# EAGLE schematic Main_Board (EAGLE 7.6.0)
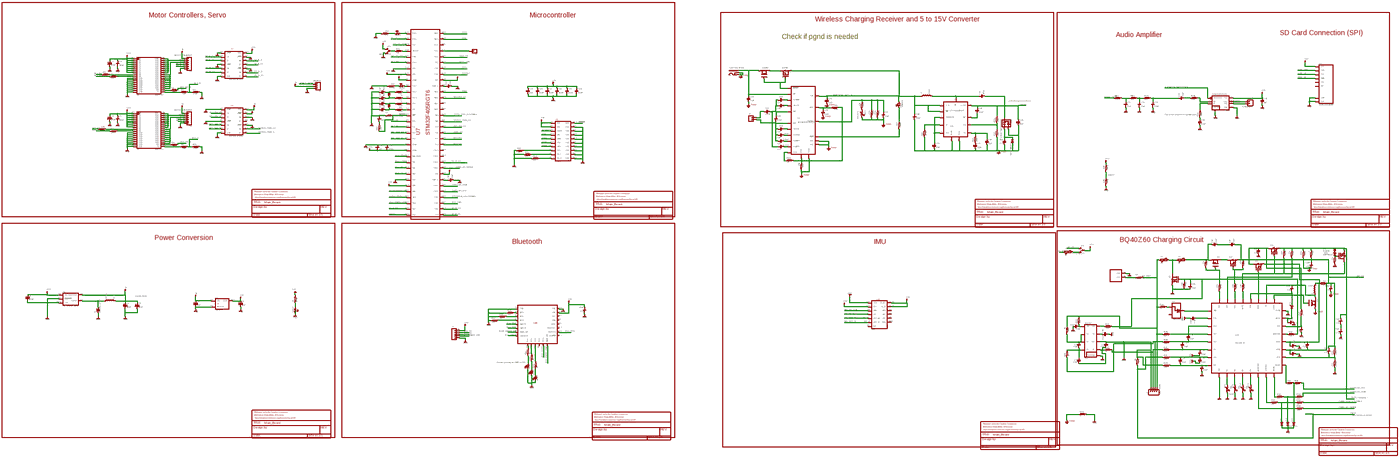
[diagram p0: schematic, sheet 1, overview]
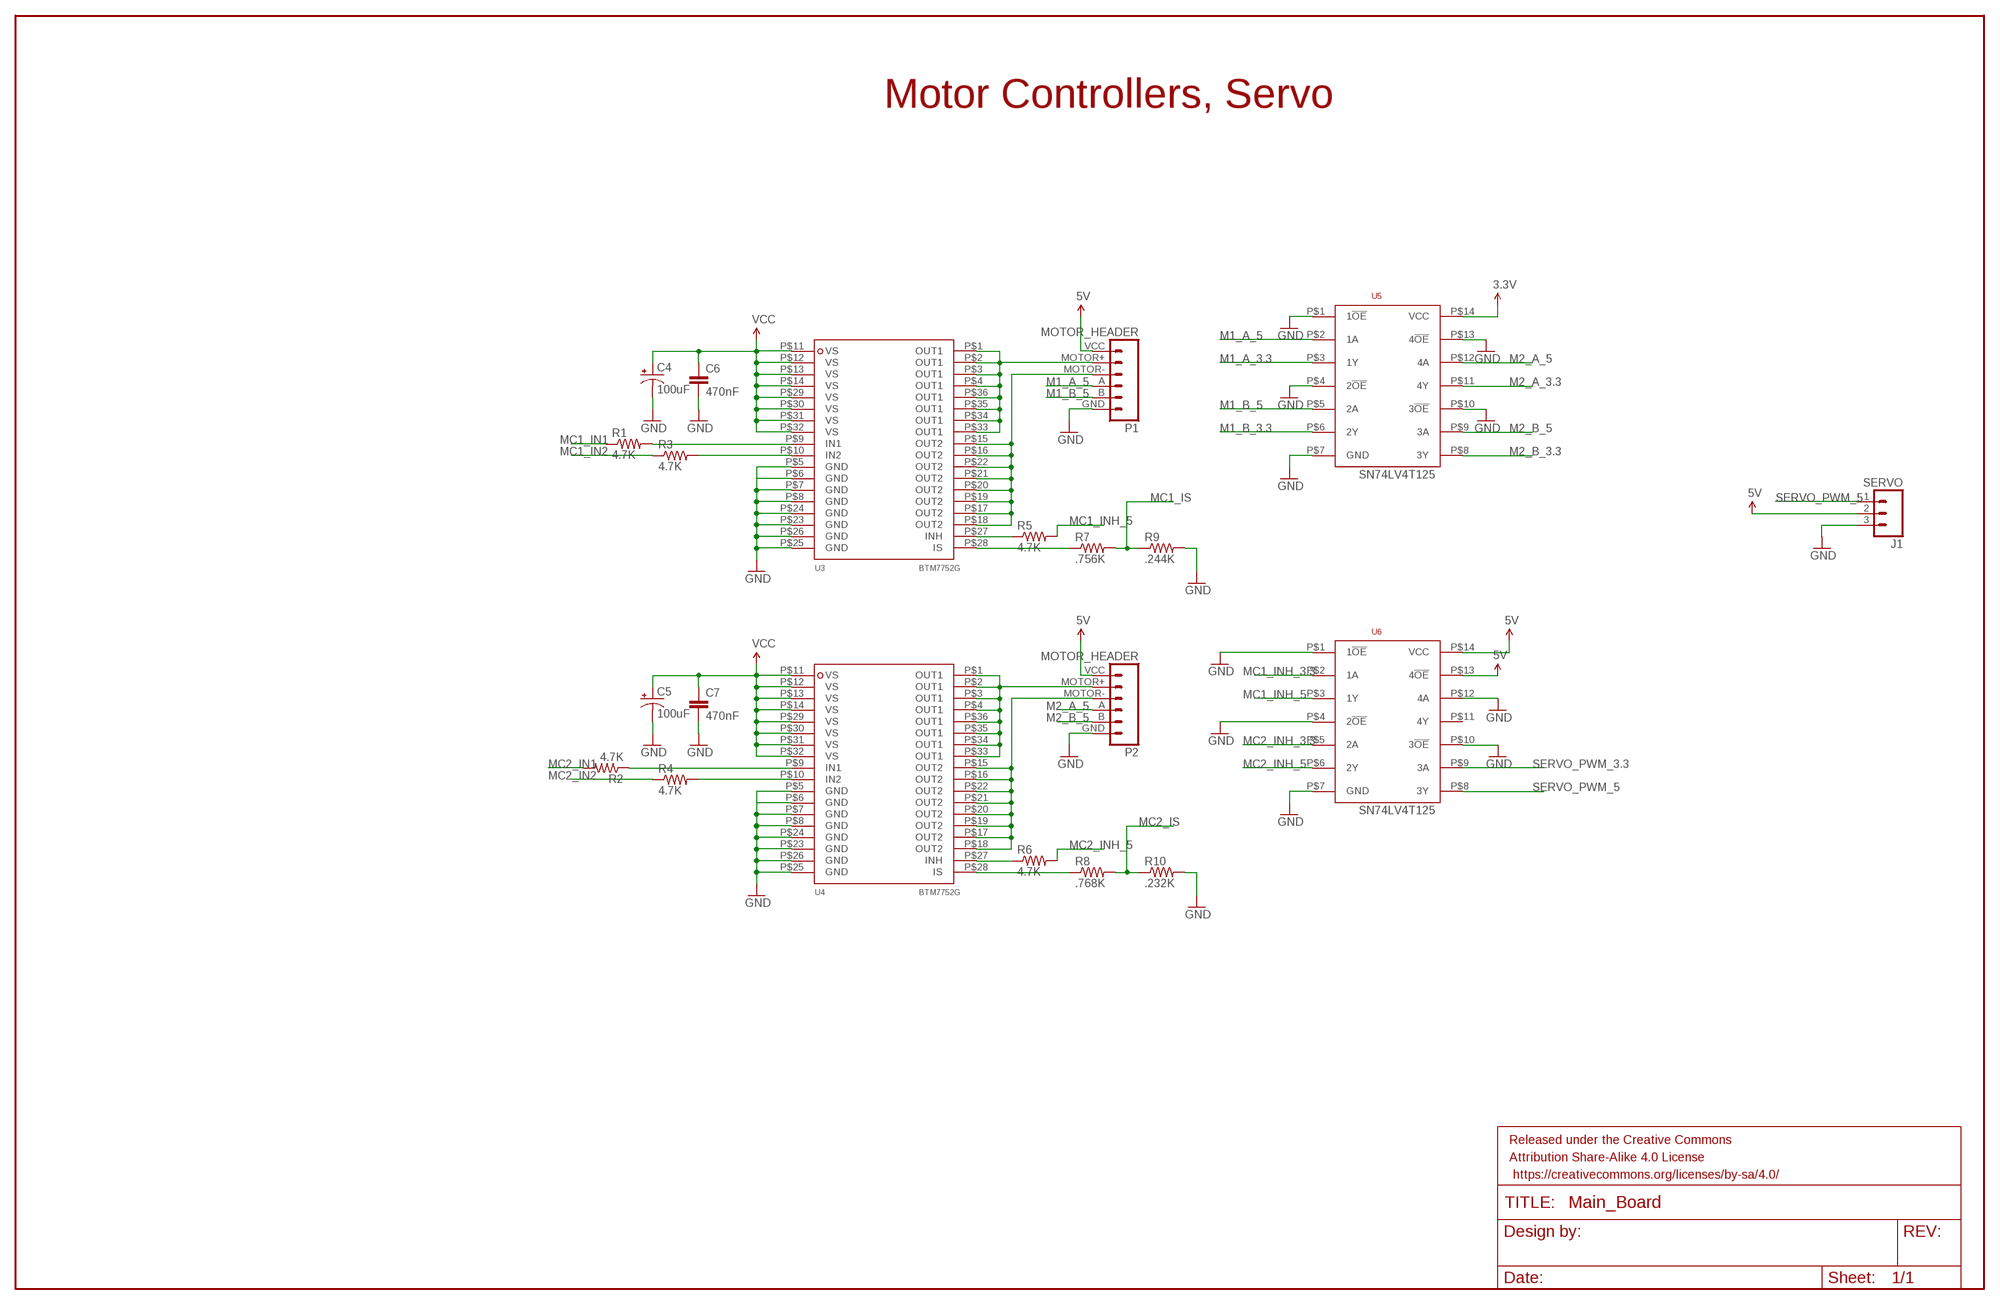
[diagram p1: schematic, sheet 1, part 1 of 8]
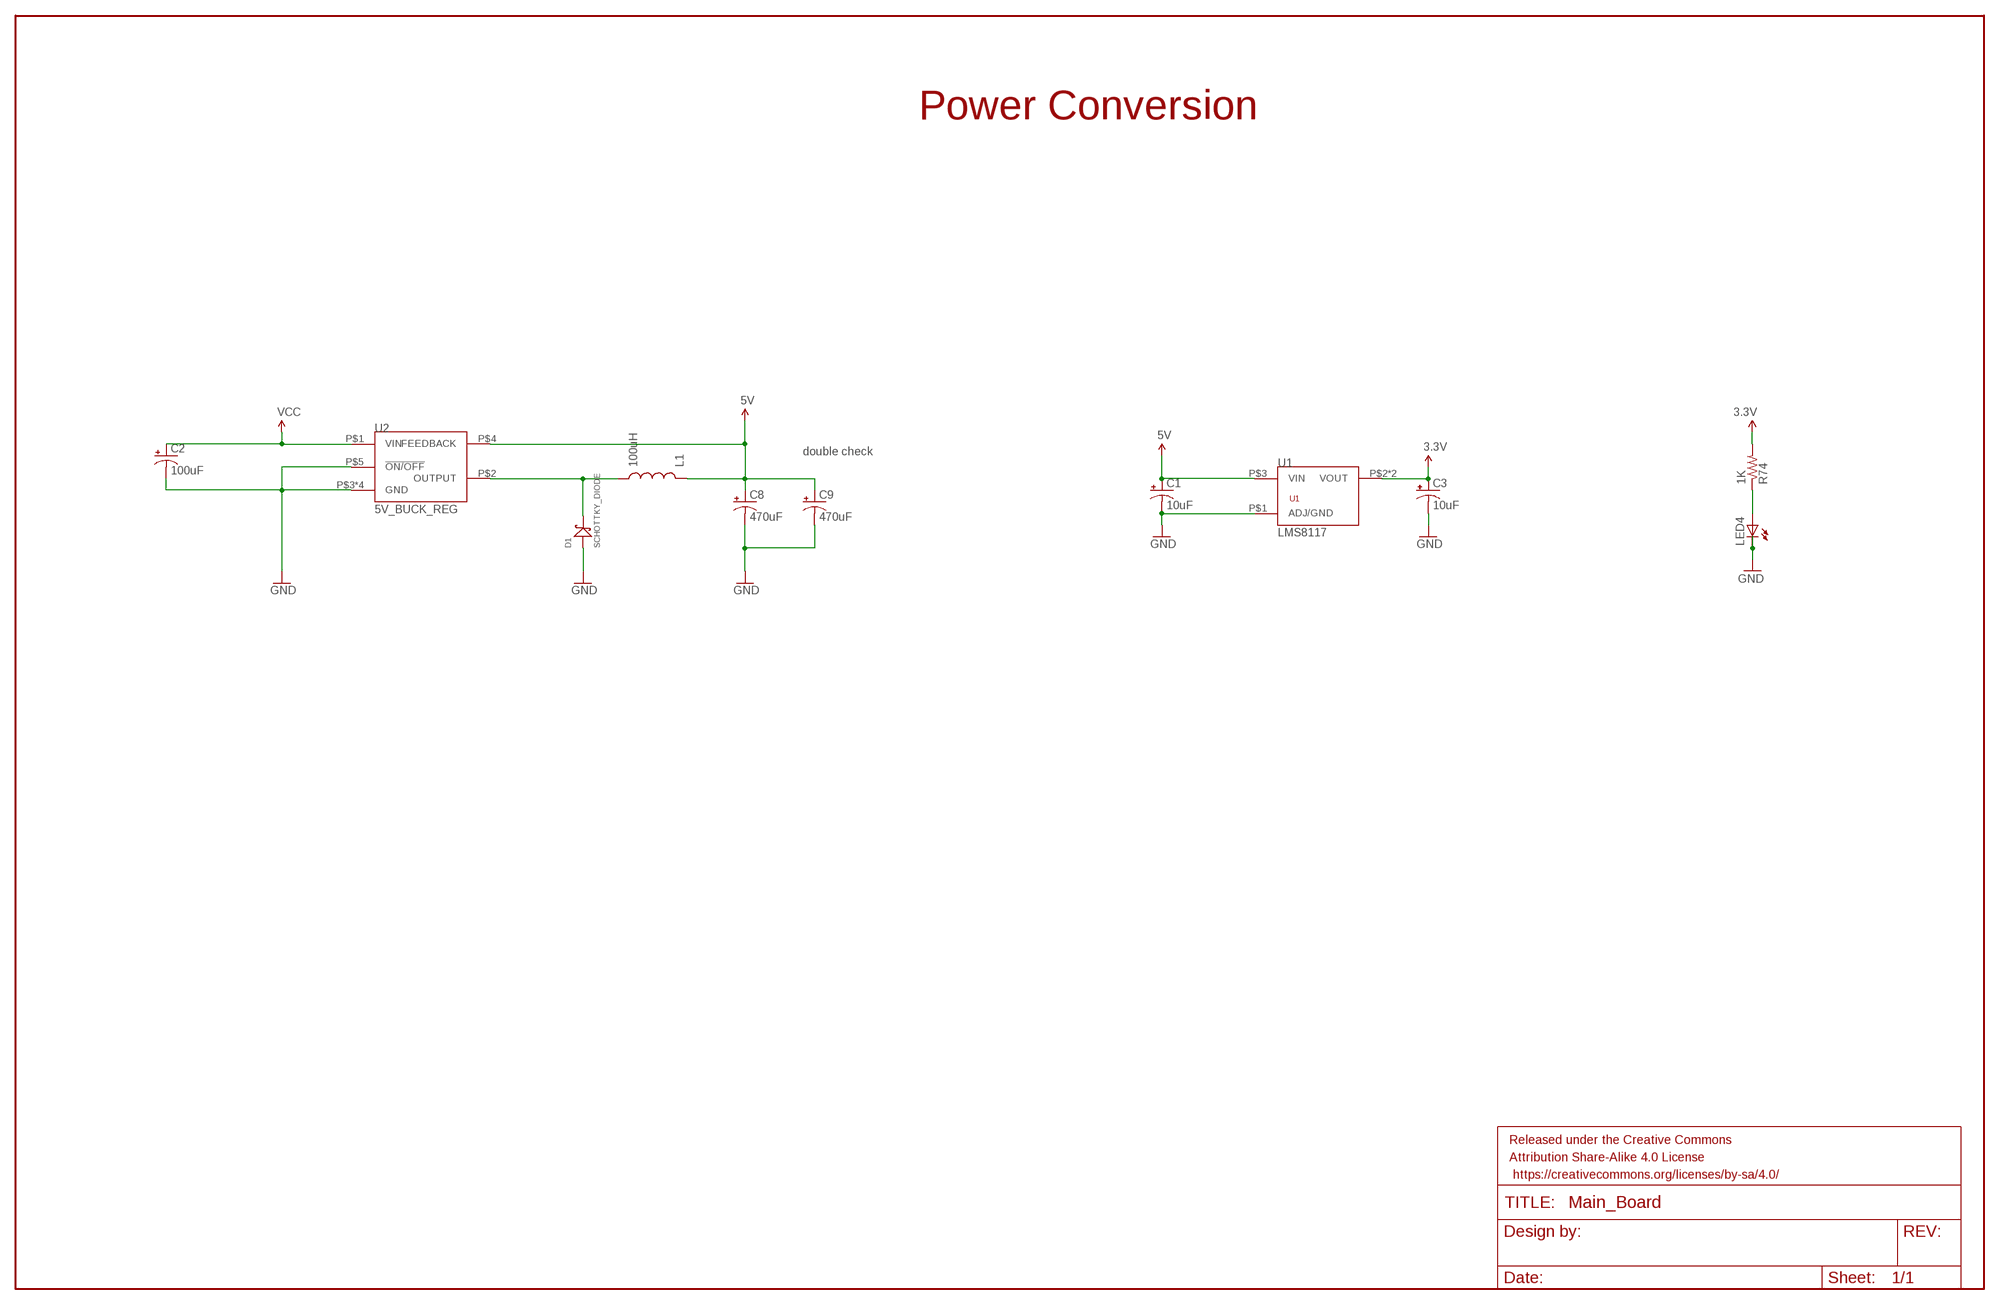
[diagram p2: schematic, sheet 1, part 2 of 8]
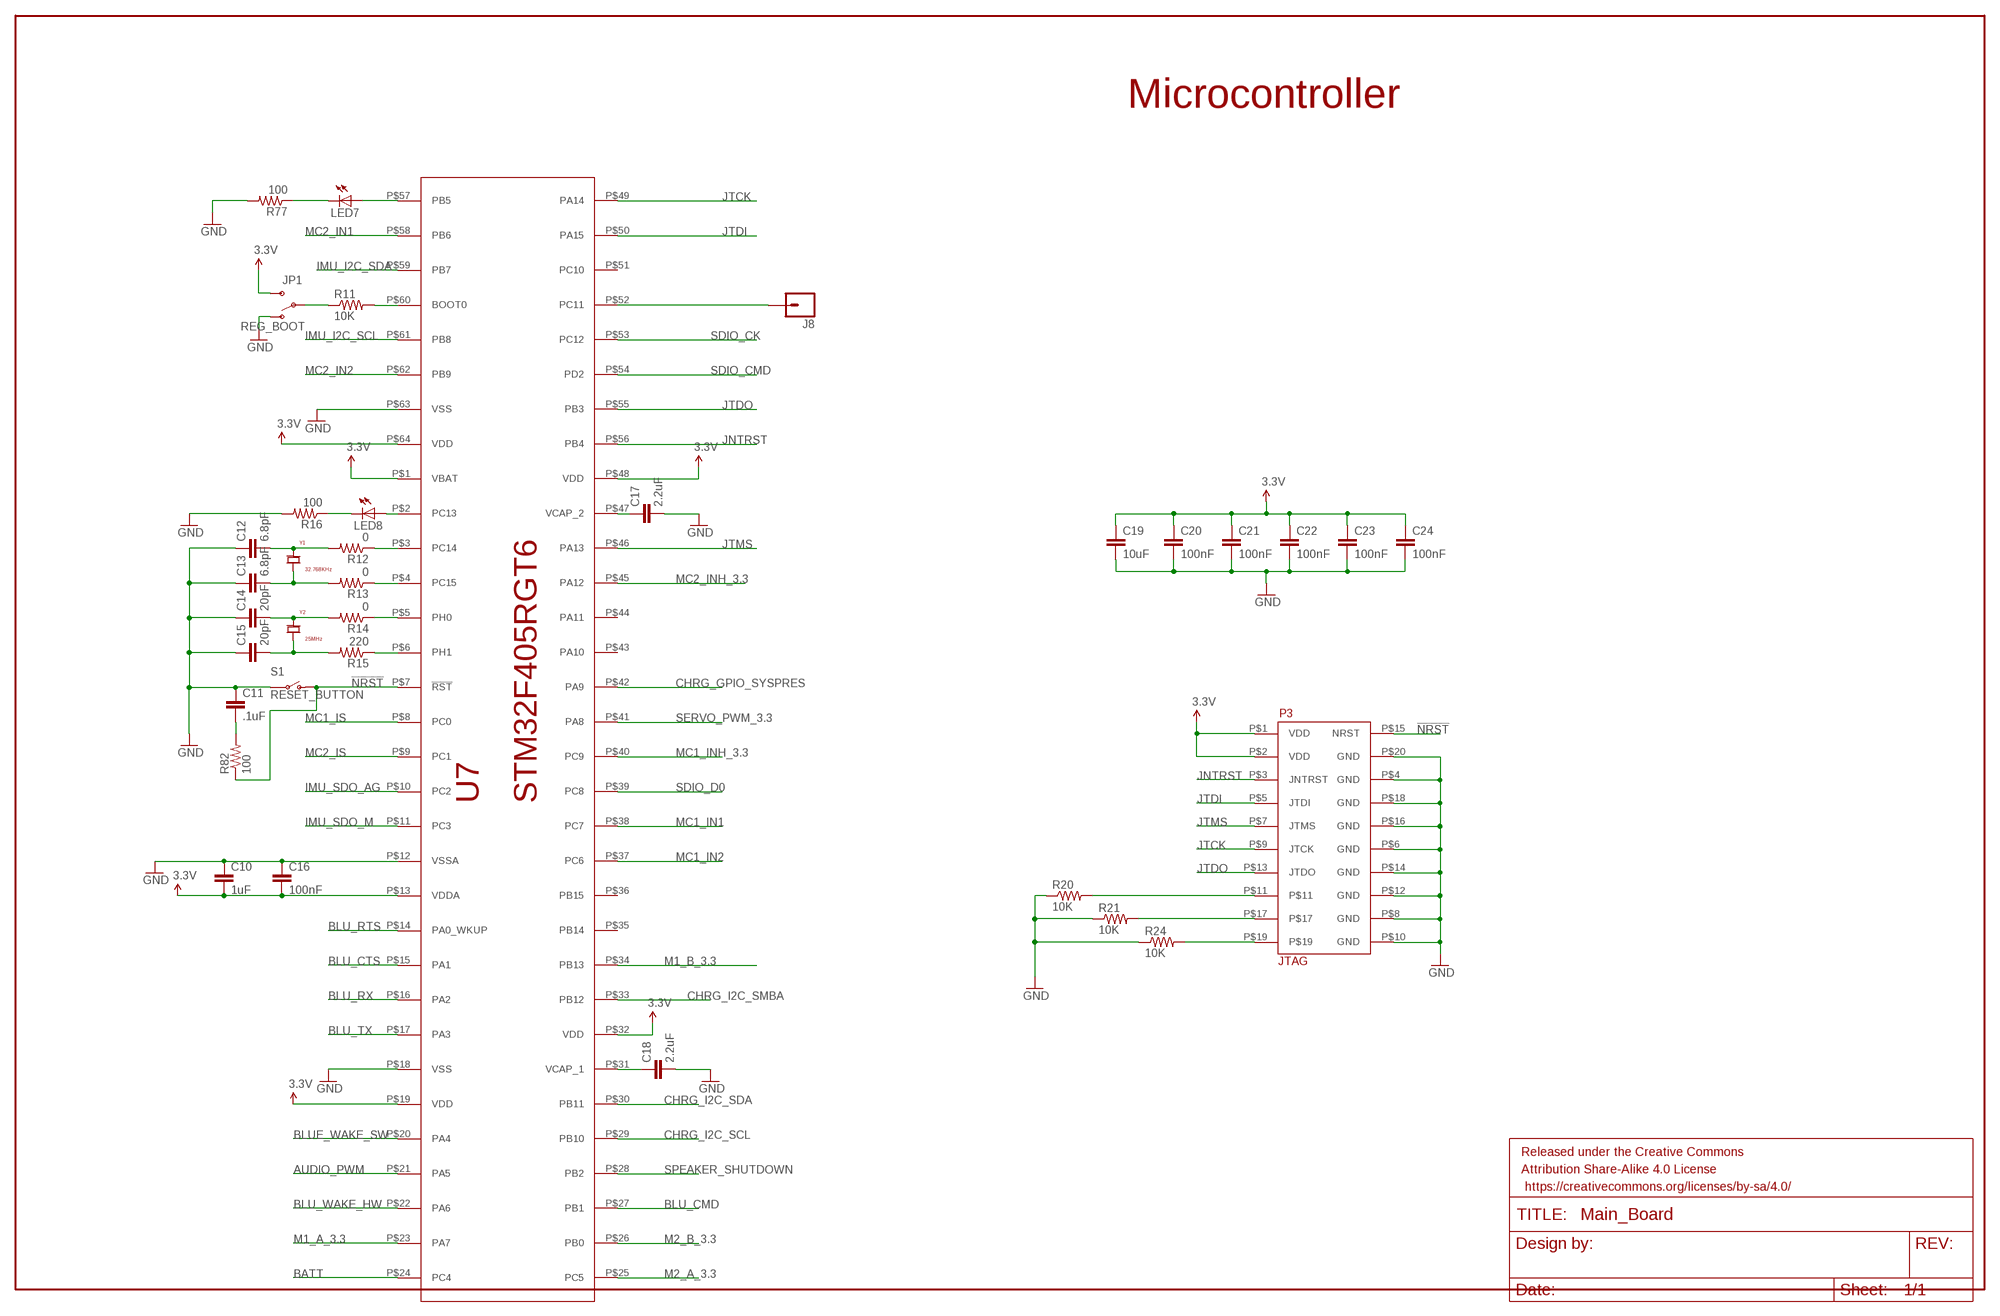
[diagram p3: schematic, sheet 1, part 3 of 8]
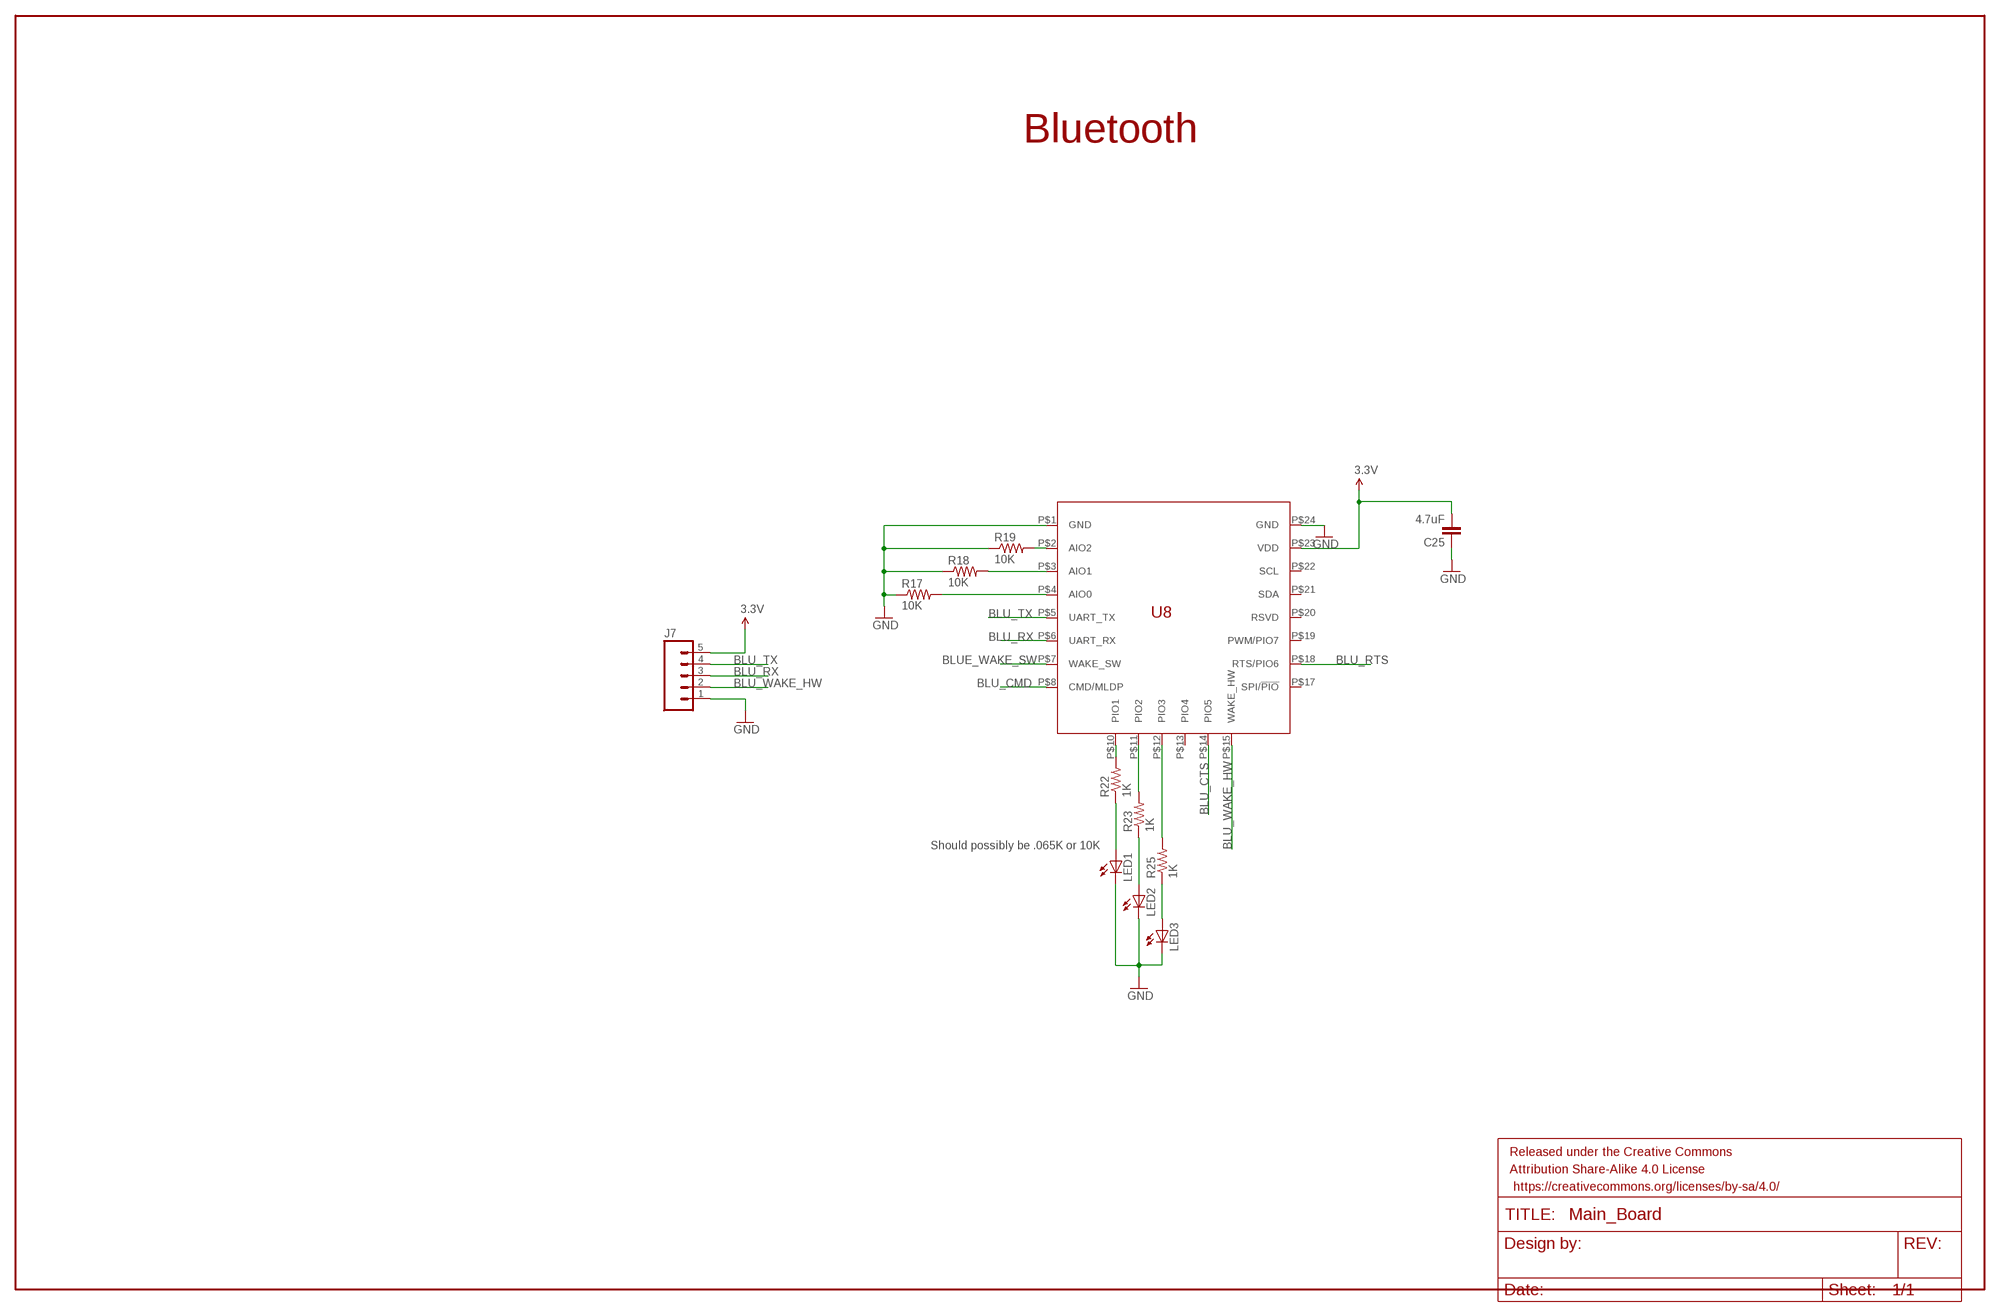
[diagram p4: schematic, sheet 1, part 4 of 8]
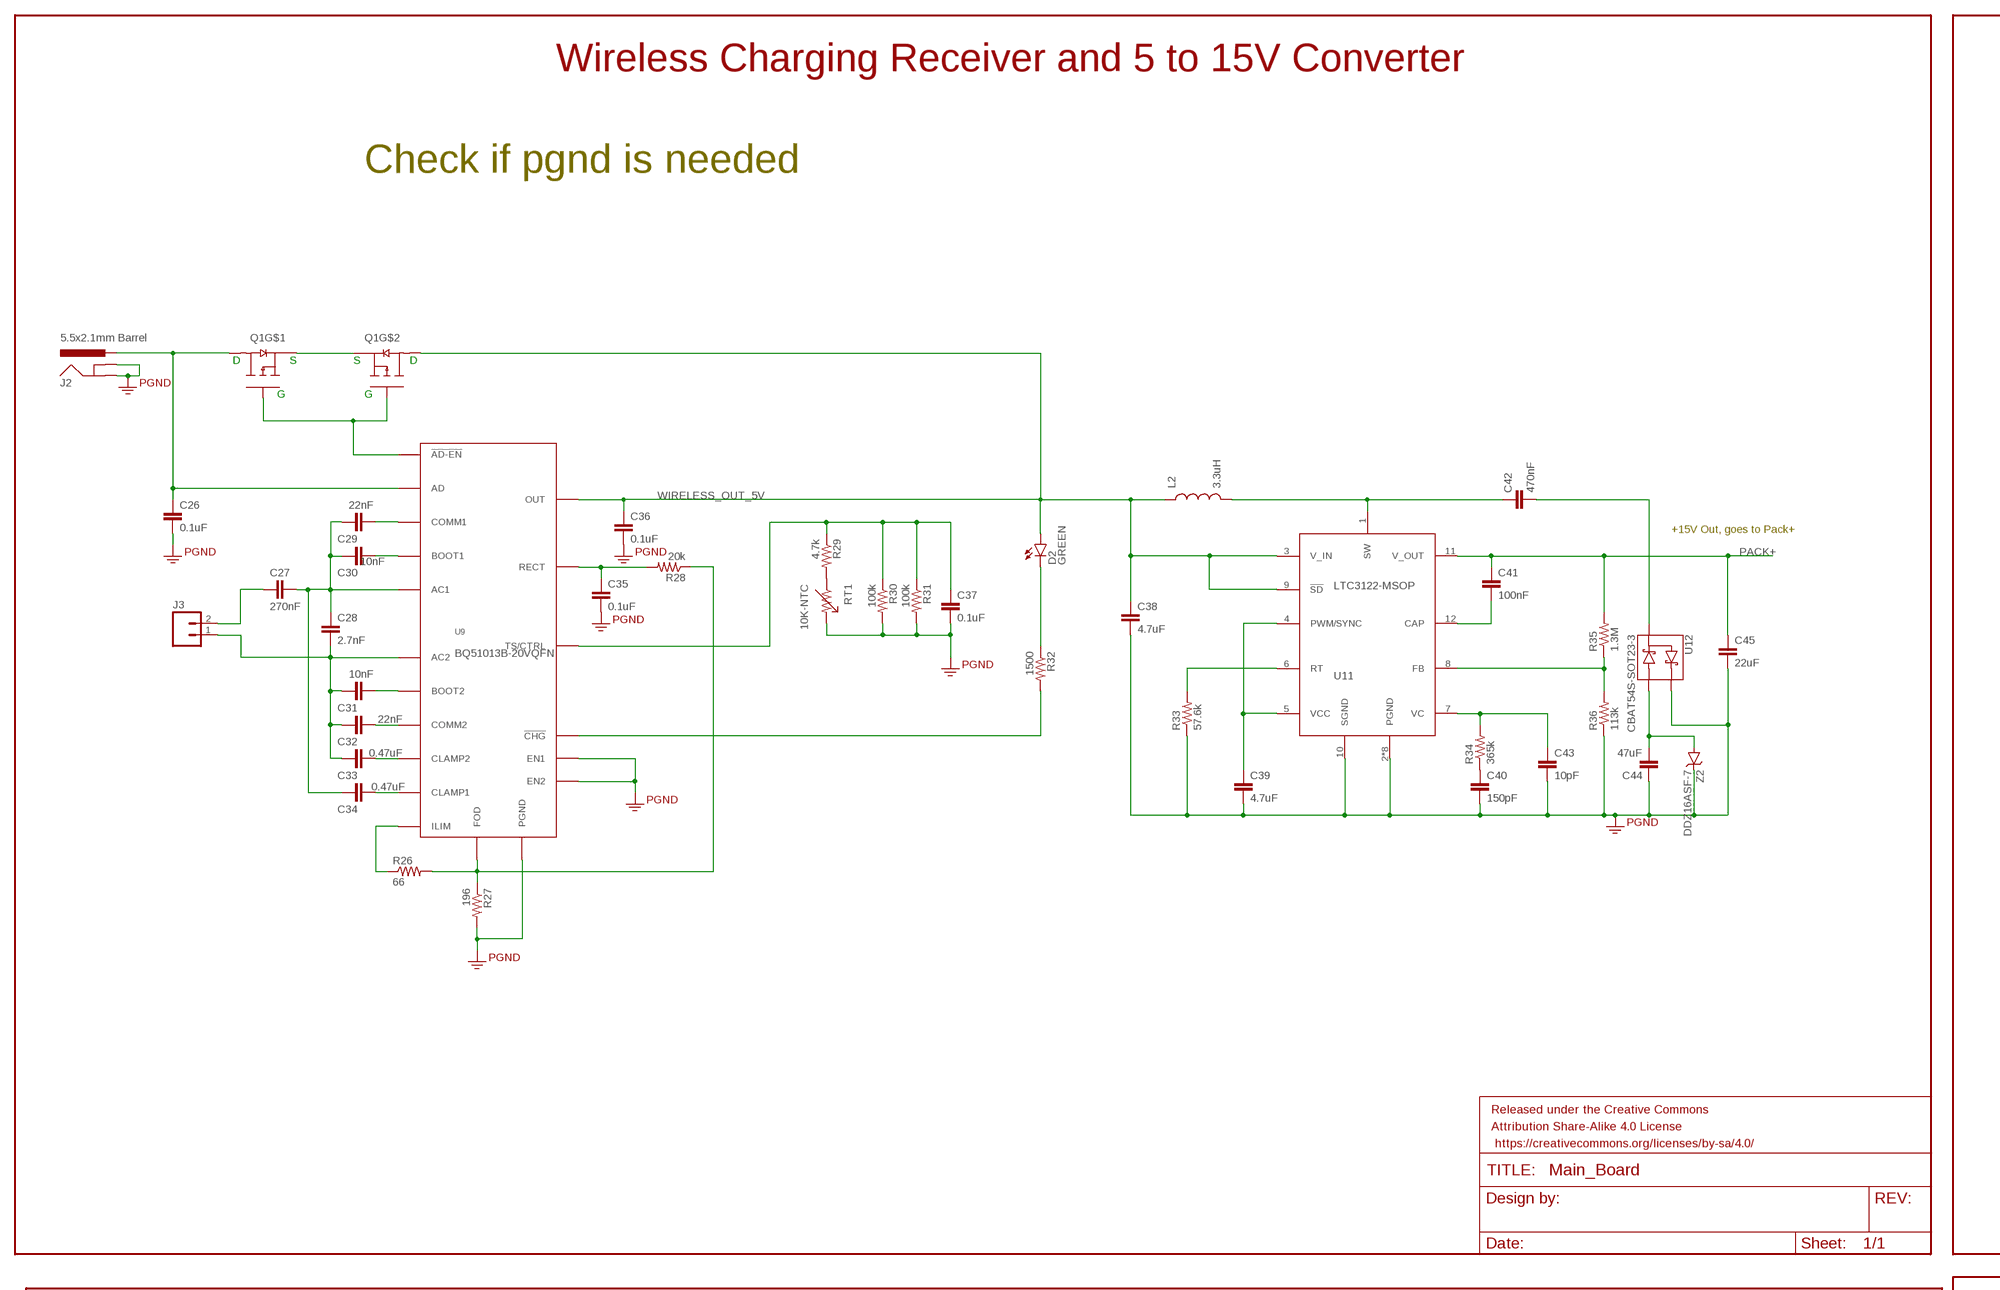
[diagram p5: schematic, sheet 1, part 5 of 8]
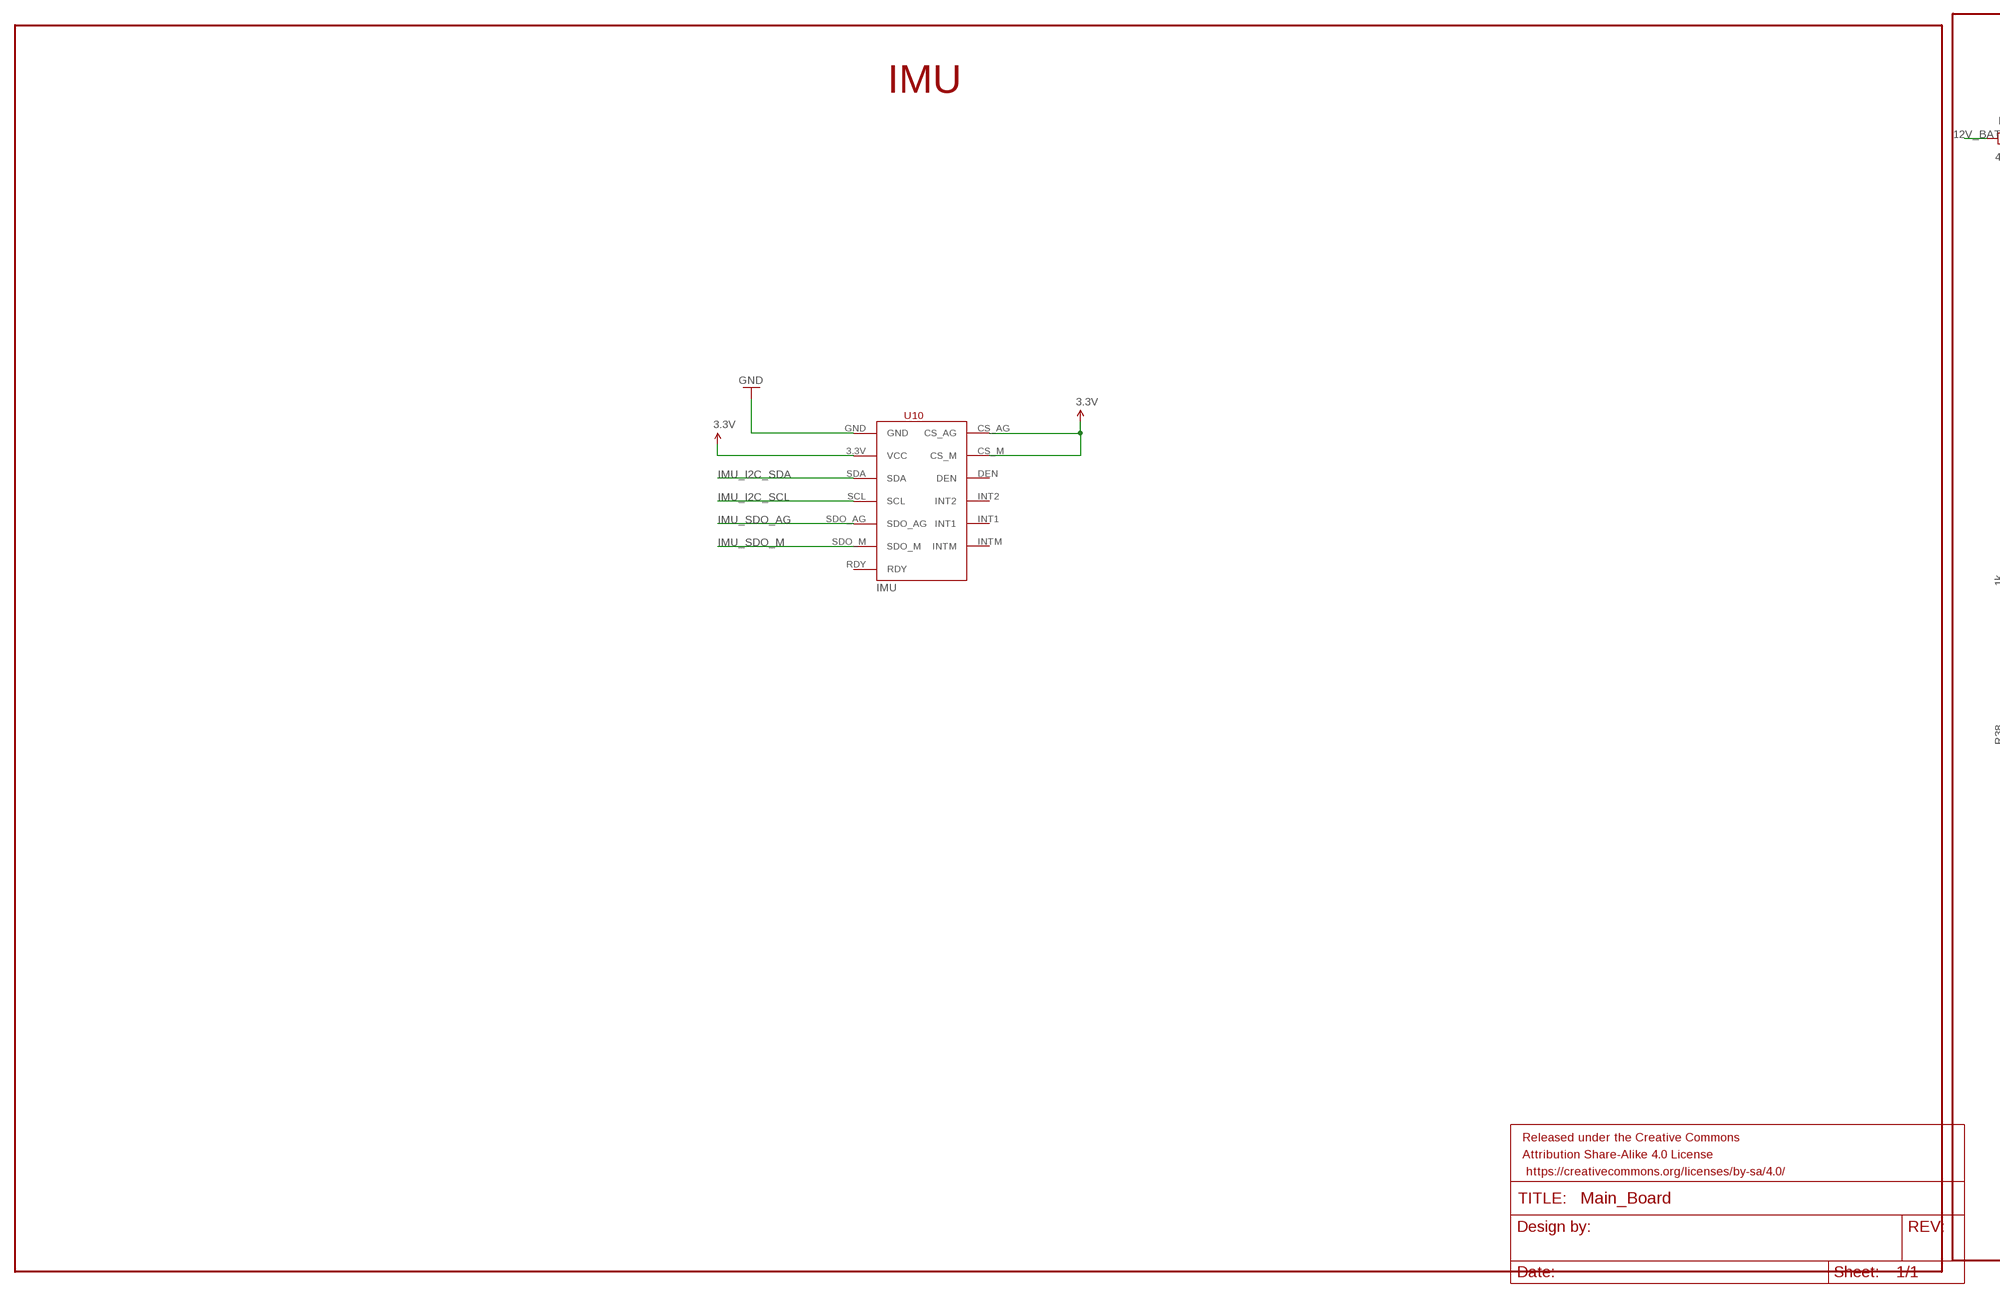
[diagram p6: schematic, sheet 1, part 6 of 8]
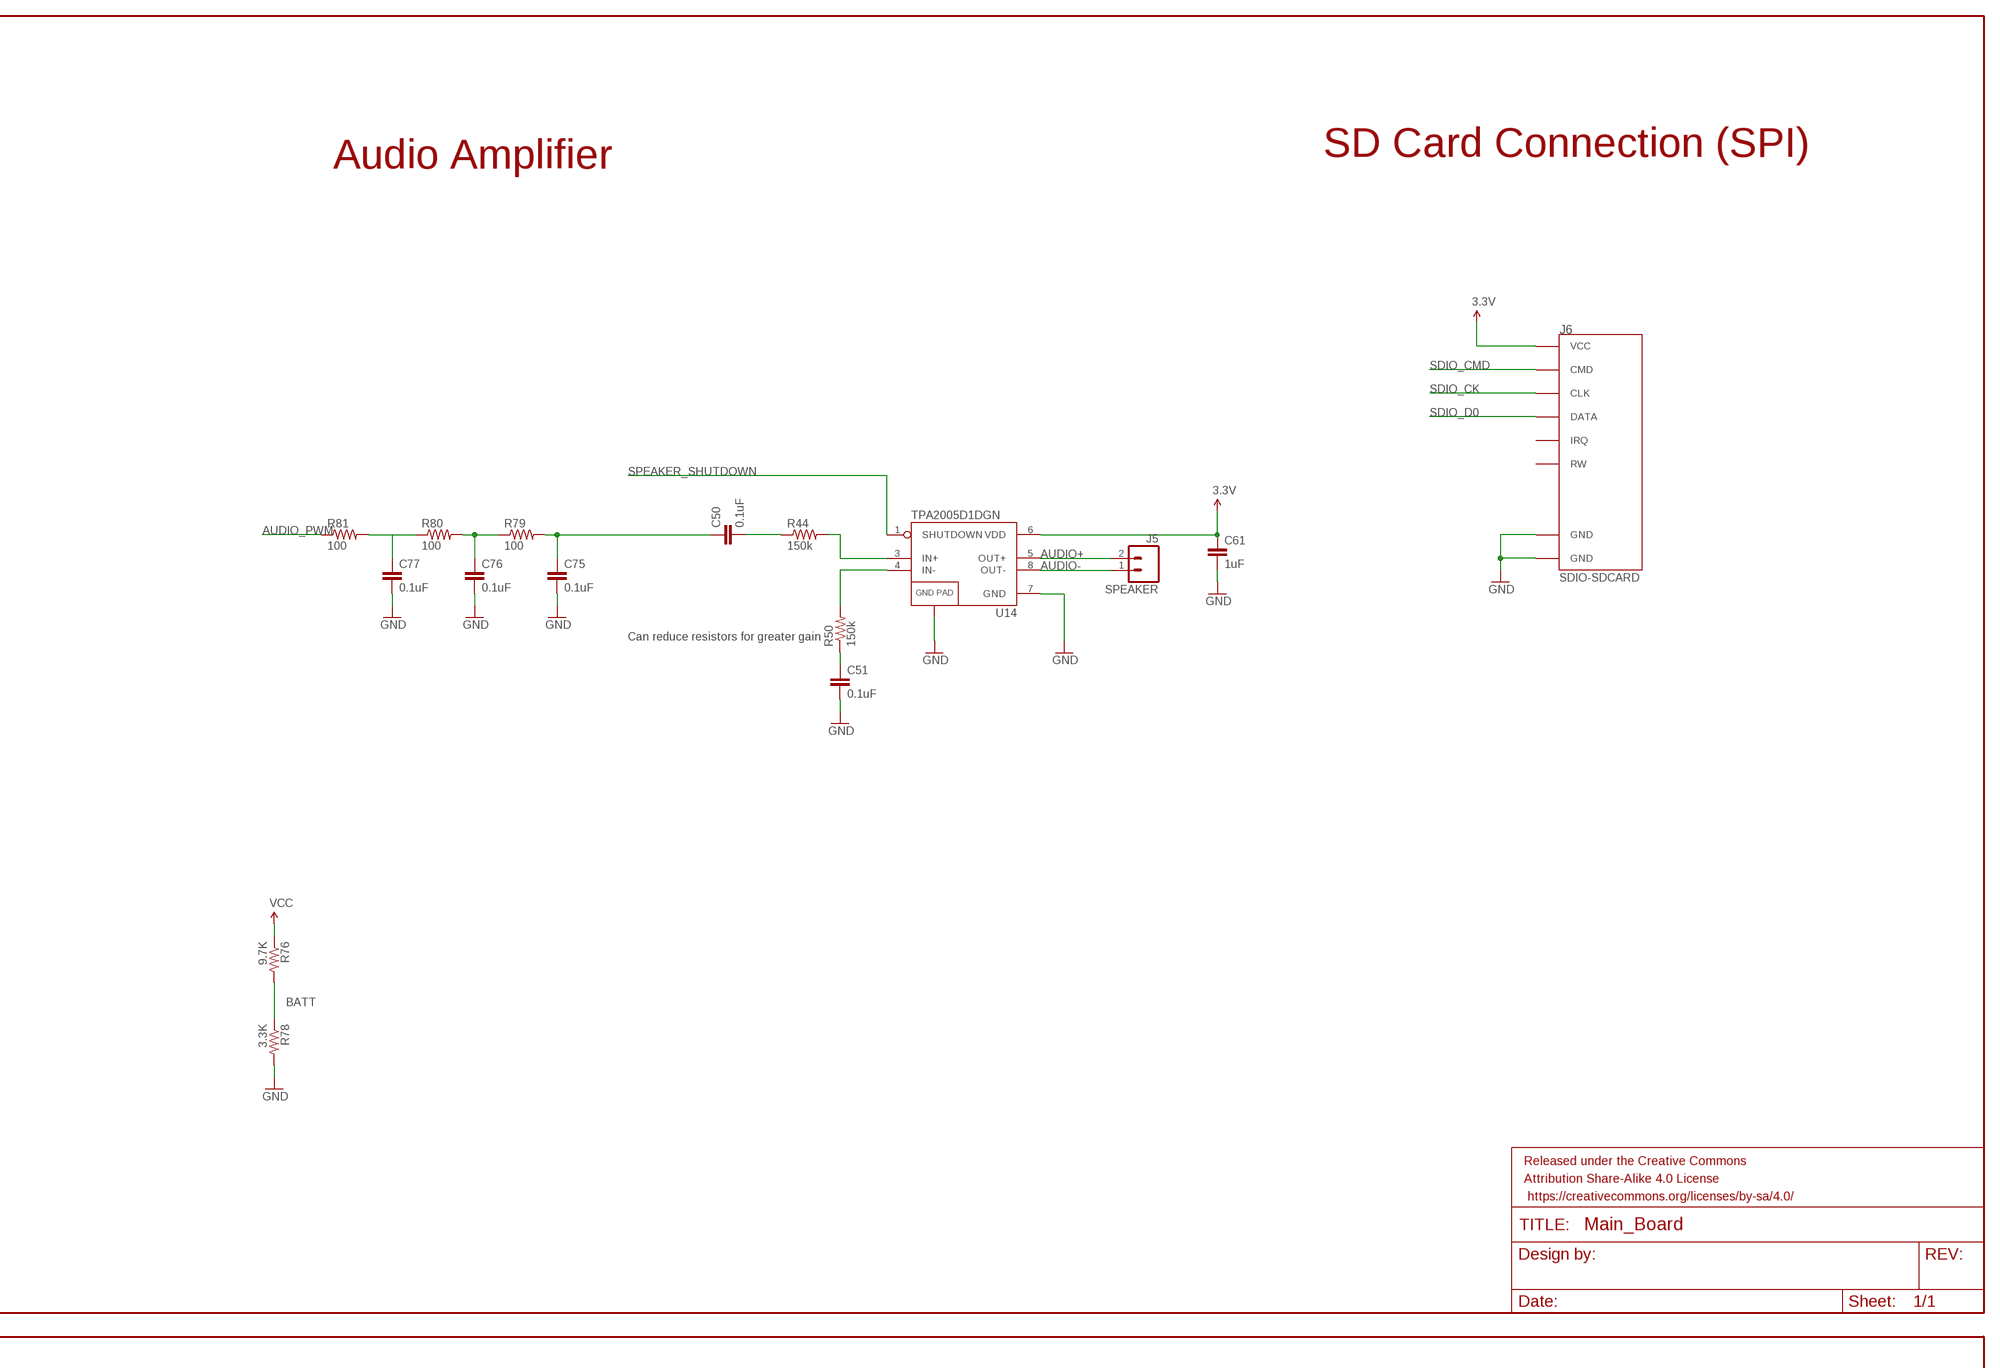
[diagram p7: schematic, sheet 1, part 7 of 8]
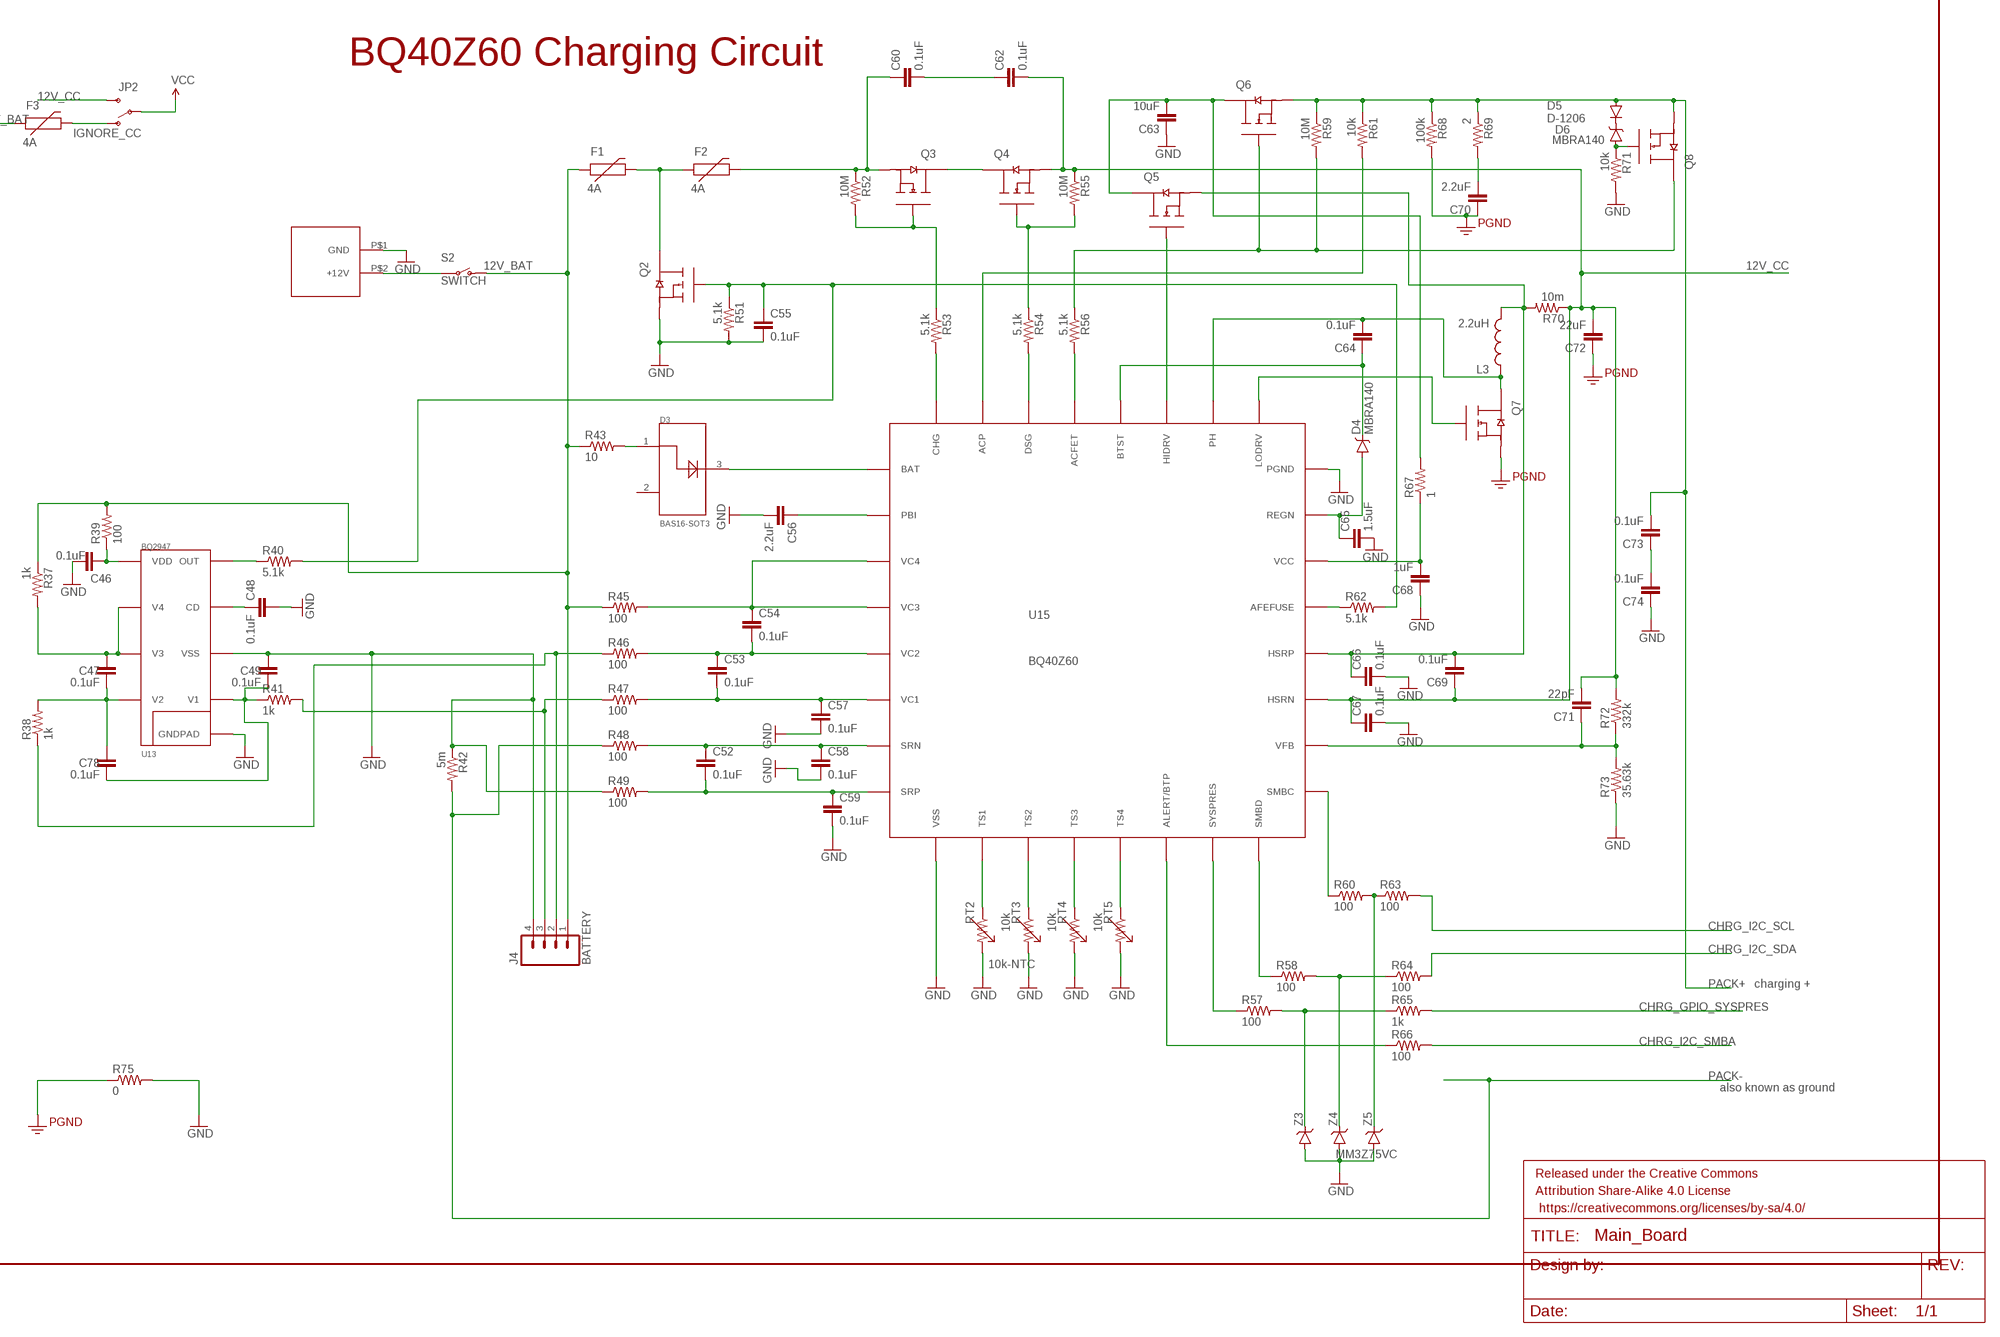
[diagram p8: schematic, sheet 1, part 8 of 8]

## Parts
C1  10uF  CAP_POL_PANB  [RADIAL_CAN_SMD-B]
C2  100uF  CAP_POL_PAN  [RADIAL_CAN_SMD-D8]
C3  10uF  CAP_POL_PANB  [RADIAL_CAN_SMD-B]
C4  100uF  CAP_POL_PAN  [RADIAL_CAN_SMD-D8]
C5  100uF  CAP_POL_PAN  [RADIAL_CAN_SMD-D8]
C6  470nF  CAP0805  [0805]
C7  470nF  CAP0805  [0805]
C8  470uF  CAP_POL_PANG  [RADIAL_CAN_SMD-G]
C9  470uF  CAP_POL_PANG  [RADIAL_CAN_SMD-G]
C10  1uF  CAP0805  [0805]
C11  .1uF  CAP0805  [0805]
C12  6.8pF  CAP0805  [0805]
C13  6.8pF  CAP0805  [0805]
C14  20pF  CAP0805  [0805]
C15  20pF  CAP0805  [0805]
C16  100nF  CAP0805  [0805]
C17  2.2uF  CAP0805  [0805]
C18  2.2uF  CAP0805  [0805]
C19  10uF  CAP0805  [0805]
C20  100nF  CAP0805  [0805]
C21  100nF  CAP0805  [0805]
C22  100nF  CAP0805  [0805]
C23  100nF  CAP0805  [0805]
C24  100nF  CAP0805  [0805]
C25  4.7uF  CAP0805  [0805]
C26  0.1uF  CAP0805  [0805]
C27  270nF  CAP0805  [0805]
C28  2.7nF  CAP0805  [0805]
C29  22nF  CAP0805  [0805]
C30  10nF  CAP0805  [0805]
C31  10nF  CAP0805  [0805]
C32  22nF  CAP0805  [0805]
C33  0.47uF  CAP0805  [0805]
C34  0.47uF  CAP0805  [0805]
C35  0.1uF  CAP0805  [0805]
C36  0.1uF  CAP0805  [0805]
C37  0.1uF  CAP0805  [0805]
C38  4.7uF  CAP0805  [0805]
C39  4.7uF  CAP0805  [0805]
C40  150pF  CAP0805  [0805]
C41  100nF  CAP0805  [0805]
C42  470nF  CAP0805  [0805]
C43  10pF  CAP0805  [0805]
C44  47uF  CAP-1206  [1206-CAP]
C45  22uF  CAP0805  [0805]
C46  0.1uF  CAP0805  [0805]
C47  0.1uF  CAP0805  [0805]
C48  0.1uF  CAP0805  [0805]
C49  0.1uF  CAP0805  [0805]
C50  0.1uF  CAP0805  [0805]
C51  0.1uF  CAP0805  [0805]
C52  0.1uF  CAP0805  [0805]
C53  0.1uF  CAP0805  [0805]
C54  0.1uF  CAP0805  [0805]
C55  0.1uF  CAP0805  [0805]
C56  2.2uF  CAP0805  [0805]
C57  0.1uF  CAP0805  [0805]
C58  0.1uF  CAP0805  [0805]
C59  0.1uF  CAP0805  [0805]
C60  0.1uF  CAP0805  [0805]
C61  1uF  CAP0805  [0805]
C62  0.1uF  CAP0805  [0805]
C63  10uF  CAP0805  [0805]
C64  0.1uF  CAP0805  [0805]
C65  1.5uF  CAP0805  [0805]
C66  0.1uF  CAP0805  [0805]
C67  0.1uF  CAP0805  [0805]
C68  1uF  CAP0805  [0805]
C69  0.1uF  CAP0805  [0805]
C70  2.2uF  CAP0805  [0805]
C71  22pF  CAP0805  [0805]
C72  22uF  CAP0805  [0805]
C73  0.1uF  CAP0805  [0805]
C74  0.1uF  CAP0805  [0805]
C75  0.1uF  CAP0805  [0805]
C76  0.1uF  CAP0805  [0805]
C77  0.1uF  CAP0805  [0805]
C78  0.1uF  CAP0805  [0805]
D1  SCHOTTKY_DIODE  [DO-214AB2]
D2  GREEN  LED-BLUE0603  [LED-0603]
D3  BAS16-SOT3  [SOT23-3]
D4  MBRA140  [SMA-DIODE]
D5  D-1206  [1206-DIODE]
D6  MBRA140  DIODE-SCHOTTKY-MBRA140  [SMA-DIODE]
F1  4A  F2875CT-ND  [PTC-2920]
F2  4A  F2875CT-ND  [PTC-2920]
F3  4A  F2875CT-ND  [PTC-2920]
FRAME1  FRAME-LEDGER  [CREATIVE_COMMONS]
FRAME2  FRAME-LEDGER  [CREATIVE_COMMONS]
FRAME3  FRAME-LEDGER  [CREATIVE_COMMONS]
FRAME4  FRAME-LEDGER  [CREATIVE_COMMONS]
FRAME5  FRAME-LEDGER  [CREATIVE_COMMONS]
FRAME6  FRAME-LEDGER  [CREATIVE_COMMONS]
FRAME7  FRAME-LEDGER  [CREATIVE_COMMONS]
FRAME8  FRAME-LEDGER  [CREATIVE_COMMONS]
J1  SERVO  M03PTH  [1X03]
J2  5.5x2.1mm Barrel  POWER_JACKSMD  [POWER_JACK_SMD]
J3  2-PIN-JUMPER  [JST-2-PTH-VERT]
J4  BATTERY  JST-XH-04  [JST-4-PTH-VERT]
J5  SPEAKER  2-PIN-JUMPER  [JST-2-PTH-VERT]
J6  SDIO-SDCARD  [SD-5738]
J7  M05PTH  [1X05]
J8  M01PTH_NO_SILK_YES_STOP  [1X01_NO_SILK]
JP1  REG_BOOT  SPDT_JUMPER  [1X03]
JP2  IGNORE_CC  SPDT_JUMPER  [1X03]
L1  100uH  SRN840-101M  [SRN8040]
L2  3.3uH  INDUCTOR-SPM6530  [SPM6530]
L3  2.2uH  INDUCTOR-SPM6530  [SPM6530]
LED1  LED1206  [LED-1206]
LED2  LED1206  [LED-1206]
LED3  LED1206  [LED-1206]
LED4  LED1206  [LED-1206]
LED7  LED1206  [LED-1206]
LED8  LED1206  [LED-1206]
P1  MOTOR_HEADER  [1X06]
P2  MOTOR_HEADER  [1X06]
P3  JTAG  [IDC20]
Q1  SI9933CDY-PFET  [SO08]
Q2  CSD17308Q3  [SON-8]
Q3  CSD17308Q3  [SON-8]
Q4  CSD17308Q3  [SON-8]
Q5  CSD17308Q3  [SON-8]
Q6  CSD17308Q3  [SON-8]
Q7  CSD17308Q3  [SON-8]
Q8  CSD17308Q3  [SON-8]
R1  4.7K  RESISTOR0805-RES  [0805]
R2  4.7K  RESISTOR0805-RES  [0805]
R3  4.7K  RESISTOR0805-RES  [0805]
R4  4.7K  RESISTOR0805-RES  [0805]
R5  4.7K  RESISTOR0805-RES  [0805]
R6  4.7K  RESISTOR0805-RES  [0805]
R7  .756K  RESISTOR0805-RES  [0805]
R8  .768K  RESISTOR0805-RES  [0805]
R9  .244K  RESISTOR0805-RES  [0805]
R10  .232K  RESISTOR0805-RES  [0805]
R11  10K  RESISTOR0805-RES  [0805]
R12  0  RESISTOR0805-RES  [0805]
R13  0  RESISTOR0805-RES  [0805]
R14  0  RESISTOR0805-RES  [0805]
R15  220  RESISTOR0805-RES  [0805]
R16  100  RESISTOR0805-RES  [0805]
R17  10K  RESISTOR0805-RES  [0805]
R18  10K  RESISTOR0805-RES  [0805]
R19  10K  RESISTOR0805-RES  [0805]
R20  10K  RESISTOR0805-RES  [0805]
R21  10K  RESISTOR0805-RES  [0805]
R22  1K  RESISTOR0805-RES  [0805]
R23  1K  RESISTOR0805-RES  [0805]
R24  10K  RESISTOR0805-RES  [0805]
R25  1K  RESISTOR0805-RES  [0805]
R26  66  RESISTOR0805-RES  [0805]
R27  196  RESISTOR0805-RES  [0805]
R28  20k  RESISTOR0805-RES  [0805]
R29  4.7k  RESISTOR0805-RES  [0805]
R30  100k  RESISTOR0805-RES  [0805]
R31  100k  RESISTOR0805-RES  [0805]
R32  1500  RESISTOR0805-RES  [0805]
R33  57.6k  RESISTOR0805-RES  [0805]
R34  365k  RESISTOR0805-RES  [0805]
R35  1.3M  RESISTOR0805-RES  [0805]
R36  113k  RESISTOR0805-RES  [0805]
R37  1k  RESISTOR0805-RES  [0805]
R38  1k  RESISTOR0805-RES  [0805]
R39  100  RESISTOR0805-RES  [0805]
R40  5.1k  RESISTOR0805-RES  [0805]
R41  1k  RESISTOR0805-RES  [0805]
R42  5m  RESISTOR0805-RES  [0805]
R43  10  RESISTOR0805-RES  [0805]
R44  150k  RESISTOR0805-RES  [0805]
R45  100  RESISTOR0805-RES  [0805]
R46  100  RESISTOR0805-RES  [0805]
R47  100  RESISTOR0805-RES  [0805]
R48  100  RESISTOR0805-RES  [0805]
R49  100  RESISTOR0805-RES  [0805]
R50  150k  RESISTOR0805-RES  [0805]
R51  5.1k  RESISTOR0805-RES  [0805]
R52  10M  RESISTOR0805-RES  [0805]
R53  5.1k  RESISTOR0805-RES  [0805]
R54  5.1k  RESISTOR0805-RES  [0805]
R55  10M  RESISTOR0805-RES  [0805]
R56  5.1k  RESISTOR0805-RES  [0805]
R57  100  RESISTOR0805-RES  [0805]
R58  100  RESISTOR0805-RES  [0805]
R59  10M  RESISTOR0805-RES  [0805]
R60  100  RESISTOR0805-RES  [0805]
R61  10k  RESISTOR0805-RES  [0805]
R62  5.1k  RESISTOR0805-RES  [0805]
R63  100  RESISTOR0805-RES  [0805]
R64  100  RESISTOR0805-RES  [0805]
R65  1k  RESISTOR0805-RES  [0805]
R66  100  RESISTOR0805-RES  [0805]
R67  1  RESISTOR0805-RES  [0805]
R68  100k  RESISTOR0805-RES  [0805]
R69  2  RESISTOR0805-RES  [0805]
R70  10m  RESISTOR0805-RES  [0805]
R71  10k  RESISTOR0805-RES  [0805]
R72  332k  RESISTOR0805-RES  [0805]
R73  35.63k  RESISTOR0805-RES  [0805]
R74  1K  RESISTOR0805-RES  [0805]
R75  0  RESISTOR0805-RES  [0805]
R76  9.7K  RESISTOR0805-RES  [0805]
R77  100  RESISTOR0805-RES  [0805]
R78  3.3K  RESISTOR0805-RES  [0805]
R79  100  RESISTOR0805-RES  [0805]
R80  100  RESISTOR0805-RES  [0805]
R81  100  RESISTOR0805-RES  [0805]
R82  100  RESISTOR0805-RES  [0805]
RT1  10K-NTC  THM  [0805]
RT2  10k-NTC  THM  [0805]
RT3  10k  THM  [0805]
RT4  10k  THM  [0805]
RT5  10k  THM  [0805]
S1  RESET_BUTTON  [5.2X5.2]
S2  SWITCH  [SWITCH]
U1  LMS8117  [SOT-223]
U2  5V_BUCK_REG  [T0-263-6]
U3  BTM7752G  [36-BSSOP]
U4  BTM7752G  [36-BSSOP]
U5  SN74LV4T125  [14-TSSOP]
U6  SN74LV4T125  [14-TSSOP]
U7  STM32F405RGT6  [LQFP64]
U8  RN4020RN4020  [RN4020]
U9  BQ51013B-20VQFN  [20-VQFN]
U10  IMU  [IMU_BREAKOUT]
U11  LTC3122-MSOP  [MSOP-12_GND]
U12  CBAT54S-SOT23-3  [SOT23-3]
U13  BQ2947  [WSON-8]
U14  TPA2005D1DGN  [POWER-SOP8]
U15  BQ40Z60  [S-PVQFN-N32]
U$1  XT60  [XT60]
Y1  32.768KHz  MC-30632.768K-E3  [4-SMD,J-LEAD]
Y2  25MHz  MA-5066-25.0000M-C0  [4-SMD,J-LEAD-2]
Z2  DDZ16ASF-7  [SOD-323F]
Z3  MM3Z75VC  [SOD-323F]
Z4  MM3Z75VC  [SOD-323F]
Z5  MM3Z75VC  [SOD-323F]

## Nets
3.3V: C3.P$1(+) C10.2 C16.2 C19.1 C20.1 C21.1 C22.1 C23.1 C24.1 C25.2 C61.1 J6.P$4(VCC) J7.5 JP1.3(S) P3.P$1(VDD) P3.P$2(VDD) R74.2 U1.P$2(VOUT) U1.P$4(VOUT) U5.P$14(VCC) U7.P$1(VBAT) U7.P$13(VDDA) U7.P$19(VDD) U7.P$32(VDD) U7.P$48(VDD) U7.P$64(VDD) U8.P$23(VDD) U10.3.3V(VCC) U10.CS_AG U10.CS_M U14.6(VDD)
5V: C1.P$1(+) C8.P$1(+) C9.P$1(+) J1.2 L1.P$1 P1.VCC P2.VCC U1.P$3(VIN) U2.P$4(FEEDBACK) U6.P$13(4!OE) U6.P$14(VCC)
12V_BAT: F1.1 F3.1 J4.1 R37.1 R39.2 R43.1 R45.1 S2.P$4(O)
12V_CC: C62.2 C67.1 C69.1 C71.2 C72.2 JP2.3(S) Q4.P$1(S1) Q4.P$2(S1) Q4.P$3(S1) R55.1 R70.1 R72.2 U15.P$19(HSRN)
!NRST: P3.P$15(NRST) R82.1 S1.P$1(O) S1.P$2(O) U7.P$7(!RST)
AC1: C27.2 C28.1 C29.1 C30.1 C34.1 U9.P$2(AC1)
AC2: C28.2 C31.1 C32.1 C33.1 J3.1 U9.P$19(AC2)
AUDIO+: J5.2 U14.5(OUT+)
AUDIO-: J5.1 U14.8(OUT-)
AUDIO_PWM: R81.1 U7.P$21(PA5)
BATT: R76.2 R78.1 U7.P$24(PC4)
BLU_CMD: U7.P$27(PB1) U8.P$8(CMD/MLDP)
BLU_CTS: U7.P$15(PA1) U8.P$14(PIO5)
BLU_RTS: U7.P$14(PA0_WKUP) U8.P$18(RTS/PIO6)
BLU_RX: J7.3 U7.P$16(PA2) U8.P$6(UART_RX)
BLU_TX: J7.4 U7.P$17(PA3) U8.P$5(UART_TX)
BLU_WAKE_HW: J7.2 U7.P$22(PA6) U8.P$15(WAKE_HW)
BLUE_WAKE_SW: U7.P$20(PA4) U8.P$7(WAKE_SW)
BOOT2: C31.2 U9.P$17(BOOT2)
CHRG_GPIO_SYSPRES: R65.2 U7.P$42(PA9)
CHRG_I2C_SCL: R63.2 U7.P$29(PB10)
CHRG_I2C_SDA: R64.2 U7.P$30(PB11)
CHRG_I2C_SMBA: R66.2 U7.P$33(PB12)
GND: C1.P$2(-) C2.P$2(-) C3.P$2(-) C4.P$2(-) C5.P$2(-) C6.2 C7.2 C8.P$2(-) C9.P$2(-) C10.1 C11.1 C12.1 C13.1 C14.1 C15.1 C16.1 C17.2 C18.2 C19.2 C20.2 C21.2 C22.2 C23.2 C24.2 C25.1 C46.2 C48.2 C49.1 C51.2 C55.2 C56.2 C57.2 C58.2 C59.2 C61.2 C63.1 C65.2 C66.2 C67.2 C68.1 C74.1 C75.2 C76.2 C77.2 D1.A J1.3 J4.4 J6.P$3(GND) J6.P$6(GND) J7.1 JP1.1(O) LED1.C LED2.C LED3.C LED4.C P1.GND P2.GND P3.P$4(GND) P3.P$6(GND) P3.P$8(GND) P3.P$10(GND) P3.P$12(GND) P3.P$14(GND) P3.P$16(GND) P3.P$18(GND) P3.P$20(GND) Q2.P$1(S1) Q2.P$2(S1) Q2.P$3(S1) R9.2 R10.2 R16.2 R17.1 R18.1 R19.1 R20.1 R21.1 R24.1 R42.1 R49.1 R51.2 R71.2 R73.1 R75.2 R77.2 R78.2 RT2.2 RT3.2 RT4.2 RT5.2 S1.P$3(P) S1.P$4(P) U1.P$1(ADJ/GND) U2.P$3(GND) U2.P$5(!ON/OFF) U2.P$6(GND) U2.P$7(GND) U2.P$8(GND) U3.P$5(GND) U3.P$6(GND) U3.P$7(GND) U3.P$8(GND) U3.P$23(GND) U3.P$24(GND) U3.P$25(GND) U3.P$26(GND) U4.P$5(GND) U4.P$6(GND) U4.P$7(GND) U4.P$8(GND) U4.P$23(GND) U4.P$24(GND) U4.P$25(GND) U4.P$26(GND) U5.P$1(1!OE) U5.P$4(2!OE) U5.P$7(GND) U5.P$10(3!OE) U5.P$13(4!OE) U6.P$1(1!OE) U6.P$4(2!OE) U6.P$7(GND) U6.P$10(3!OE) U6.P$12(4A) U7.P$12(VSSA) U7.P$18(VSS) U7.P$63(VSS) U8.P$1(GND) U8.P$24(GND) U10.GND U13.P$6(VSS) U13.P$GND(GNDPAD) U14.7(GND) U14.9(GND) U15.P$9(VSS) U15.P$24(PGND) U15.P$33(PGND) U15.P$34(PGND) U15.P$35(PGND) U15.P$36(PGND) U15.P$37(PGND) U15.P$38(PGND) U15.P$39(PGND) U15.P$40(PGND) U15.P$41(PGND) U15.P$GND(VSS) U$1.P$1(GND) Z3.1(A) Z4.1(A) Z5.1(A)
IMU_I2C_SCL: U7.P$61(PB8) U10.SCL
IMU_I2C_SDA: U7.P$59(PB7) U10.SDA
IMU_SDO_AG: U7.P$10(PC2) U10.SDO_AG
IMU_SDO_M: U7.P$11(PC3) U10.SDO_M
JNTRST: P3.P$3(JNTRST) U7.P$56(PB4)
JTCK: P3.P$9(JTCK) U7.P$49(PA14)
JTDI: P3.P$5(JTDI) U7.P$50(PA15)
JTDO: P3.P$13(JTDO) U7.P$55(PB3)
JTMS: P3.P$7(JTMS) U7.P$46(PA13)
M1_A_3.3: U5.P$3(1Y) U7.P$23(PA7)
M1_A_5: P1.A U5.P$2(1A)
M1_B_3.3: U5.P$6(2Y) U7.P$34(PB13)
M1_B_5: P1.B U5.P$5(2A)
M2_A_3.3: U5.P$11(4Y) U7.P$25(PC5)
M2_A_5: P2.A U5.P$12(4A)
M2_B_3.3: U5.P$8(3Y) U7.P$26(PB0)
M2_B_5: P2.B U5.P$9(3A)
MC1_IN1: R1.1 U7.P$38(PC7)
MC1_IN2: R3.1 U7.P$37(PC6)
MC1_INH_3.3: U6.P$2(1A) U7.P$40(PC9)
MC1_INH_5: R5.2 U6.P$3(1Y)
MC1_IS: R7.2 R9.1 U7.P$8(PC0)
MC2_IN1: R2.2 U7.P$58(PB6)
MC2_IN2: R4.1 U7.P$62(PB9)
MC2_INH_3.3: U6.P$5(2A) U7.P$45(PA12)
MC2_INH_5: R6.2 U6.P$6(2Y)
MC2_IS: R8.2 R10.1 U7.P$9(PC1)
N$1: P1.MOTOR+ U3.P$1(OUT1) U3.P$2(OUT1) U3.P$3(OUT1) U3.P$4(OUT1) U3.P$33(OUT1) U3.P$34(OUT1) U3.P$35(OUT1) U3.P$36(OUT1)
N$2: P1.MOTOR- U3.P$15(OUT2) U3.P$16(OUT2) U3.P$17(OUT2) U3.P$18(OUT2) U3.P$19(OUT2) U3.P$20(OUT2) U3.P$21(OUT2) U3.P$22(OUT2)
N$3: R1.2 U3.P$9(IN1)
N$4: R3.2 U3.P$10(IN2)
N$5: R7.1 U3.P$28(IS)
N$6: R5.1 U3.P$27(INH)
N$7: R19.2 U8.P$2(AIO2)
N$8: P2.MOTOR+ U4.P$1(OUT1) U4.P$2(OUT1) U4.P$3(OUT1) U4.P$4(OUT1) U4.P$33(OUT1) U4.P$34(OUT1) U4.P$35(OUT1) U4.P$36(OUT1)
N$9: P2.MOTOR- U4.P$15(OUT2) U4.P$16(OUT2) U4.P$17(OUT2) U4.P$18(OUT2) U4.P$19(OUT2) U4.P$20(OUT2) U4.P$21(OUT2) U4.P$22(OUT2)
N$10: R2.1 U4.P$9(IN1)
N$11: R4.2 U4.P$10(IN2)
N$12: C12.2 R12.2 Y1.P$1
N$13: R8.1 U4.P$28(IS)
N$14: R6.1 U4.P$27(INH)
N$15: C17.1 U7.P$47(VCAP_2)
N$16: C18.1 U7.P$31(VCAP_1)
N$17: C15.2 R15.2 Y2.P$4
N$18: C13.2 R13.2 Y1.P$2
N$19: R14.1 U7.P$5(PH0)
N$20: C14.2 R14.2 Y2.P$1
N$21: R13.1 U7.P$4(PC15)
N$22: R11.2 U7.P$60(BOOT0)
N$23: JP1.2(P) R11.1
N$24: P3.P$11 R20.2
N$25: P3.P$17 R21.2
N$26: P3.P$19 R24.2
N$27: F3.2 JP2.1(O)
N$28: R17.2 U8.P$4(AIO0)
N$29: R12.1 U7.P$3(PC14)
N$30: R15.1 U7.P$6(PH1)
N$31: D1.C L1.P$2 U2.P$2(OUTPUT)
N$32: S2.P$3(P) U$1.P$2(+12V)
N$33: J4.3 R41.2 R47.1
N$34: R22.2 U8.P$10(PIO1)
N$35: LED1.A R22.1
N$36: R23.2 U8.P$11(PIO2)
N$37: R25.2 U8.P$12(PIO3)
N$38: LED2.A R23.1
N$39: LED3.A R25.1
N$40: C47.1 R37.2 U13.P$2(V4) U13.P$3(V3)
N$41: LED8.A U7.P$2(PC13)
N$42: LED4.A R74.1
N$43: J8.1 U7.P$52(PC11)
N$44: C77.1 R80.1 R81.2
N$45: C76.1 R79.1 R80.2
N$46: C47.2 C78.1 R38.2 U13.P$4(V2)
N$47: C50.1 C75.1 R79.2
N$48: R18.2 U8.P$3(AIO1)
N$49: F1.2 F2.1 Q2.P$5(D1) Q2.P$6(D1) Q2.P$7(D1) Q2.P$8(D1) Q2.P$9(D1)
N$50: C40.1 R34.1
N$51: C39.1 U11.4(PWM/SYNC) U11.5(VCC)
N$52: R33.2 U11.6(RT)
N$53: C42.1 L2.P$2 U11.1(SW)
N$54: C32.2 U9.P$15(COMM2)
N$55: C33.2 U9.P$16(CLAMP2)
N$56: C34.2 U9.P$5(CLAMP1)
N$57: C30.2 U9.P$3(BOOT1)
N$58: C29.2 U9.P$6(COMM1)
N$59: C27.1 J3.2
N$60: R26.1 U9.P$12(ILIM)
N$61: R26.2 R27.1 R28.1 U9.P$14(FOD)
N$62: C35.1 R28.2 U9.P$18(RECT)
N$63: R32.2 U9.P$7(!CHG)
N$64: R50.2 U14.4(IN-)
N$65: C50.2 R44.1
N$66: C51.1 R50.1
N$67: R44.2 U14.3(IN+)
N$68: RT2.1 U15.P$10(TS1)
N$69: RT3.1 U15.P$11(TS2)
N$70: RT4.1 U15.P$12(TS3)
N$71: RT5.1 U15.P$13(TS4)
N$72: R66.1 U15.P$14(ALERT/BTP)
N$73: R57.1 U15.P$15(SYSPRES)
N$74: R57.2 R65.1 Z3.2(C)
N$75: R58.1 U15.P$16(SMBD)
N$76: R58.2 R64.1 Z4.2(C)
N$77: R60.1 U15.P$17(SMBC)
N$78: R60.2 R63.1 Z5.2(C)
N$79: C71.1 R72.1 R73.2 U15.P$18(VFB)
N$80: C66.1 C69.2 L3.P$2 Q5.P$1(S1) Q5.P$2(S1) Q5.P$3(S1) R70.2 U15.P$20(HSRP)
N$81: D6.A Q8.P$4(G1) R71.1
N$82: Q6.P$4(G1) Q8.P$5(D1) Q8.P$6(D1) Q8.P$7(D1) Q8.P$8(D1) Q8.P$9(D1) R56.1 R59.2
N$83: R56.2 U15.P$29(ACFET)
N$84: C73.1 C74.2
N$85: C64.1 D4.C U15.P$28(BTST)
N$86: C65.1 D4.A U15.P$23(REGN)
N$87: C64.2 L3.P$1 Q7.P$5(D1) Q7.P$6(D1) Q7.P$7(D1) Q7.P$8(D1) Q7.P$9(D1) U15.P$26(PH)
N$88: C55.1 Q2.P$4(G1) R40.2 R51.1 R62.2
N$89: C68.2 R67.1 U15.P$22(VCC)
N$90: R62.1 U15.P$21(AFEFUSE)
N$91: D5.D(C) D6.C
N$92: C70.2 R69.2
N$93: Q7.P$4(G1) U15.P$25(LODRV)
N$94: C63.2 Q5.P$5(D1) Q5.P$6(D1) Q5.P$7(D1) Q5.P$8(D1) Q5.P$9(D1) Q6.P$5(D1) Q6.P$6(D1) Q6.P$7(D1) Q6.P$8(D1) Q6.P$9(D1) R67.2
N$95: Q5.P$4(G1) U15.P$27(HIDRV)
N$96: R54.2 U15.P$31(DSG)
N$97: Q4.P$4(G1) R54.1 R55.2
N$98: R61.2 U15.P$30(ACP)
N$99: Q3.P$5(D1) Q3.P$6(D1) Q3.P$7(D1) Q3.P$8(D1) Q3.P$9(D1) Q4.P$5(D1) Q4.P$6(D1) Q4.P$7(D1) Q4.P$8(D1) Q4.P$9(D1)
N$100: C60.2 C62.1
N$101: C60.1 F2.2 Q3.P$1(S1) Q3.P$2(S1) Q3.P$3(S1) R52.1
N$102: Q3.P$4(G1) R52.2 R53.1
N$103: R53.2 U15.P$32(CHG)
N$104: LED8.C R16.1
N$105: D3.3 U15.P$1(BAT)
N$106: D3.1 R43.2
N$107: C56.1 U15.P$2(PBI)
N$108: C54.1 R45.2 U15.P$3(VC4) U15.P$4(VC3)
N$109: C41.2 U11.12(CAP)
N$110: C53.1 C54.2 R46.2 U15.P$5(VC2)
N$111: C53.2 C57.1 R47.2 U15.P$6(VC1)
N$112: C52.1 C58.1 R48.2 U15.P$7(SRN)
N$113: C52.2 C59.1 R49.2 U15.P$8(SRP)
N$114: R40.1 U13.P$8(OUT)
N$115: D2.C R32.1
N$116: J4.2 R38.1 R46.1
N$117: R35.1 R36.2 U11.8(FB)
N$118: C46.1 R39.1 U13.P$1(VDD)
N$119: C43.1 R34.2 U11.7(VC)
N$120: C42.2 U12.3
N$121: C49.2 C78.2 R41.1 U13.P$5(V1)
N$122: C48.1 U13.P$7(CD)
N$123: C44.2 U12.1 Z2.1(A)
N$124: C37.1 R29.1 R30.1 R31.1 U9.P$13(TS/CTRL)
N$125: Q1.2(G) Q1.4(G) U9.P$8(!AD-EN)
N$126: R29.2 RT1.1
N$127: Q1.1(S) Q1.3(S)
N$128: C26.1 J2.VIN0(PWR) Q1.7(D) Q1.8(D) U9.P$9(AD)
N$129: C11.2 R82.2
N$133: LED7.A U7.P$57(PB5)
N$134: LED7.C R77.1
PACK+: C41.1 C45.1 C73.2 D5.A Q6.P$1(S1) Q6.P$2(S1) Q6.P$3(S1) Q8.P$1(S1) Q8.P$2(S1) Q8.P$3(S1) R35.2 R59.1 R61.1 R68.1 R69.1 U11.11(V_OUT)
PACK-: R42.2 R48.1
PGND: C26.2 C35.2 C36.2 C37.2 C38.2 C39.2 C40.2 C43.2 C44.1 C45.2 C70.1 C72.1 J2.GND(GNDBREAK) J2.P$4(GND) Q7.P$1(S1) Q7.P$2(S1) Q7.P$3(S1) R27.2 R30.2 R31.2 R33.1 R36.1 R68.2 R75.1 RT1.2 U9.P$1(PGND) U9.P$10(EN1) U9.P$11(EN2) U9.P$20(PGND) U9.P$21(PGND) U9.P$22(PGND) U9.P$23(PGND) U9.P$24(PGND) U9.P$25(PGND) U9.P$26(PGND) U9.P$27(PGND) U11.2(PGND) U11.10(SGND) U11.13(PGND) U11.P$1(PGND) U11.P$2(PGND) U11.P$3(PGND) U11.P$4(PGND) U11.P$5(PGND) U11.P$6(PGND) U12.2 Z2.2(C)
SDIO_CK: J6.P$5(CLK) U7.P$53(PC12)
SDIO_CMD: J6.P$2(CMD) U7.P$54(PD2)
SDIO_D0: J6.P$7(DATA) U7.P$39(PC8)
SERVO_PWM_3.3: U6.P$9(3A) U7.P$41(PA8)
SERVO_PWM_5: J1.1 U6.P$8(3Y)
SPEAKER_SHUTDOWN: U7.P$28(PB2) U14.1(SHUTDOWN)
VCC: C2.P$1(+) C4.P$1(+) C5.P$1(+) C6.1 C7.1 JP2.2(P) R76.1 U2.P$1(VIN) U3.P$11(VS) U3.P$12(VS) U3.P$13(VS) U3.P$14(VS) U3.P$29(VS) U3.P$30(VS) U3.P$31(VS) U3.P$32(VS) U4.P$11(VS) U4.P$12(VS) U4.P$13(VS) U4.P$14(VS) U4.P$29(VS) U4.P$30(VS) U4.P$31(VS) U4.P$32(VS)
WIRELESS_OUT_5V: C36.1 C38.1 D2.A L2.P$1 Q1.5(D) Q1.6(D) U9.P$4(OUT) U11.3(V_IN) U11.9(!SD)
Unconnected: D3.2 J6.P$8(IRQ) J6.P$9(RW) U6.P$11(4Y) U7.P$35(PB14) U7.P$36(PB15) U7.P$43(PA10) U7.P$44(PA11) U7.P$51(PC10) U8.P$13(PIO4) U8.P$17(SPI/!PIO) U8.P$19(PWM/PIO7) U8.P$20(RSVD) U8.P$21(SDA) U8.P$22(SCL) U10.DEN U10.INT1 U10.INT2 U10.INTM U10.RDY

## Notes on the sheet
- Motor Controllers, Servo | Microcontroller
- Wireless Charging Receiver and 5 to 15V Converter
- Audio Amplifier | SD Card Connection (SPI)
- Check if pgnd is needed
- +15V Out, goes to Pack+
- Can reduce resistors for greater gain
- Power Conversion | BQ40Z60 Charging Circuit
- Bluetooth | IMU
- double check
- Should possibly be .065K or 10K
- charging +
- also known as ground

## Library data of the parts
C1-C5 C8 C9 = BB8:CAP_POL_PAN
C6 C7 C10 C16-C43 C45-C78 = SparkFun-Capacitors:CAP: Capacitor Standard 0603 ceramic capacitor, and 0.1" leaded capacitor.
C11-C15 = SparkFun-Passives:CAP: Capacitor Standard 0603 ceramic capacitor, and 0.1" leaded capacitor.
C44 = BB8:CAP-1206
D1 = BB8:SCHOTTKY_DIODE
D2 = SparkFun-LED:LED-BLUE: Blue LEDs for production use Various blue LEDs stocked by SparkFun production 0603 - DIO-08575 Rebel - DIO-09553 1206 - DIO-09911; PROD_ID: DIO-08575; VALUE: BLUE
D3 = BB8:BAS16-SOT3
D4 = SparkFun-DiscreteSemi:MBRA140: 40V, 1A Schottky rectifier SMA/DO-214AC package DIO-08053; PROD_ID: DIO-08053
D5 = BB8:D-1206
D6 = SparkFun-DiscreteSemi:DIODE-SCHOTTKY: Schottky diodes in SFE's production catalog BAT20J 1A 23V 0.62Vf RB751 120mA 40V 0.37Vf PMEG4005EJ 0.5A 40V 0.42Vf MBRA140 1A 40V 0.5Vf B340A 3A 40V SMA; PROD_ID: DIO-08053
F1-F3 = BB8:F2875CT-ND
FRAME1-FRAME8 = SparkFun-Aesthetics:FRAME-LEDGER: Schematic Frame Standard 11x14 US Ledger frame
J1 = SparkFun-Connectors:M03: Header 3 Standard 3-pin 0.1" header. Use with straight break away headers (SKU : PRT-00116), right angle break away headers (PRT-00553), swiss pins (PRT-00743), machine pins (PRT-00117), and female headers (PRT-00115). Molex polarized connector foot print use with SKU : PRT-08232 with associated crimp pins and housings.
J2 = SparkFun-Connectors:POWER_JACK: Power Jack This is the standard 5.5mm barrel jack for power. The PTH is the most common, proven, reliable, footprint. The Slot footprint only works if the mill layer is transmitted to the PCB fab house so be warned. Mating wall wart : TOL-00298 (and others); PROD_ID: CONN-08106; SF_ID: PRT-12748
J3 J5 = BB8:2-PIN-JUMPER
J4 = BB8:JST-XH-04
J6 = BB8:SDIO-SDCARD
J7 = SparkFun-Connectors:M05: Header 5 Standard 5-pin 0.1" header. Use with straight break away headers (SKU : PRT-00116), right angle break away headers (PRT-00553), swiss pins (PRT-00743), machine pins (PRT-00117), and female headers (PRT-00115). Molex polarized connector foot print use with SKU : PRT-08230 with associated crimp pins and housings.
J8 = SparkFun-Connectors:M01: Header 1 Standard 1-pin 0.1" header. Use with straight break away headers (SKU : PRT-00116), right angle break away headers (PRT-00553), swiss pins (PRT-00743), machine pins (PRT-00117), and female headers (PRT-00115). SMTSO-256-ET is a "flush mount" nut for a 4-40 screw. The older package used to be too tight, and did not allow it to sit properly thru the drill hit. The latest (0.165DIA) fits nice and snug.
JP1 JP2 = BB8:SPDT_JUMPER
L1 = BB8:SRN840-101M
L2 L3 = BB8:INDUCTOR-SPM6530
LED1-LED4 LED7 LED8 = LilyPad-Wearables:LED: LEDs Standard schematic elements and footprints for 5mm, 3mm, 1206, and 0603 sized LEDs. 5mm - Spark Fun Electronics SKU : Comp-SBL
P1 P2 = BB8:MOTOR_HEADER
P3 = BB8:JTAG: http://www.digikey.com/product-detail/en/cnc-tech/3020-20-0100-00/1175-1612-ND/3441738
Q1 = BB8:SI9933CDY-PFET
Q2-Q8 = BB8:CSD17308Q3
R1-R15 R17-R36 R44 R50 R74 R76 R78-R81 = SparkFun-Passives:RESISTOR: Resistor Basic schematic elements and footprints for 0603, 1206, and PTH resistors.
R16 R37-R43 R45-R49 R51-R73 R75 R77 R82 = SparkFun-Resistors:RESISTOR: Resistor Basic schematic elements and footprints for 0603, 1206, and PTH resistors.
RT1-RT5 = BB8:THM
S1 = BB8:RESET_BUTTON: Part Number: RS-187R05A2-DS MT RT
S2 = BB8:SWITCH
U1 = BB8:LMS8117: 3.3V Linear Regulator
U2 = BB8:5V_BUCK_REG: LM2576SX-5.0/NOPB
U3 U4 = BB8:BTM7752G
U5 U6 = BB8:SN74LV4T125: Level translator
U7 = BB8:STM32F405RGT6
U8 = BB8:RN4020: Bluetooth module
U9 = BB8:BQ51013B-20VQFN
U10 = BB8:IMU
U11 = BB8:LTC3122-MSOP
U12 = BB8:CBAT54S-SOT23-3
U13 = BB8:BQ2947
U14 = SparkFun-AnalogIC:TPA2005D1: 1.4W MONO CLASS-D AUDIO POWER AMPLIFIER The TPA2005D1 is a 1.4-W high efficiency filter-free class-D audio power amplifier in a BGA, QFN, or MSOP package that requires only three external components. Datasheet: http://focus.ti.com/lit/ds/symlink/tpa2005d1.pdf 1.4 W Into 8 ? From a 5V Supply at THD = 10% (Typ) Maximum Battery Life and Minimum Heat Efficiency With an 8-? Speaker: 84% at 400 mW, 79% at 100 mW 2.8-mA Quiescent Current 0.5-mA Shutdown Current Ideal for Wireless or Cellular Handsets and PDAs Capable of Driving an 8-? Speaker (2.5 V ? VDD ? 5.5 V) and a 4-? Speaker (2.5 V ? VDD ? 4.2 V) Only Three External Components Optimized PWM Output Stage Eliminates LC Output Filter Internally Generated 250-kHz Switching Frequency Eliminates Capacitor and Resistor Improved PSRR (-71 dB at 217 Hz) and Wide Supply Voltage (2.5 V to 5.5 V) Eliminates Need for a Voltage Regulator Fully Differential Design Reduces RF Rectification and Eliminates Bypass Capacitor Improved CMRR Eliminates Two Input Coupling Capacitors
U15 = BB8:BQ40Z60
U$1 = BB8:XT60
Y1 = BB8:MC-30632.768K-E3: Oscillator
Y2 = BB8:MA-5066-25.0000M-C0
Z2 = BB8:DDZ16ASF-7
Z3-Z5 = BB8:MM3Z75VC